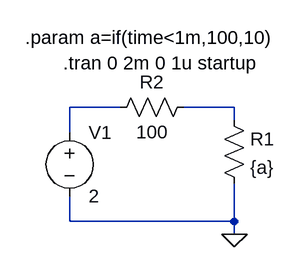
[diagram p0: schematic Draft7.asc]
Draft7.asc, the LTspice schematic file:
Version 4
SHEET 1 880 680
WIRE 192 144 128 144
WIRE 336 144 272 144
WIRE 336 160 336 144
WIRE 128 176 128 144
WIRE 128 288 128 256
WIRE 336 288 336 240
WIRE 336 288 128 288
WIRE 336 304 336 288
FLAG 336 304 0
SYMBOL voltage 128 160 R0
WINDOW 123 0 0 Left 0
WINDOW 39 0 0 Left 0
SYMATTR InstName V1
SYMATTR Value 2
SYMBOL res 320 144 R0
SYMATTR InstName R1
SYMATTR Value {a}
SYMBOL res 288 128 R90
WINDOW 0 0 56 VBottom 2
WINDOW 3 32 56 VTop 2
SYMATTR InstName R2
SYMATTR Value 100
TEXT 72 56 Left 2 !.param a=if(time<1m,100,10)
TEXT 120 88 Left 2 !.tran 0 2m 0 1u startup

The netlist it stands for:
* Draft7.asc
V1 N001 0 2
R1 N002 0 {a}
R2 N002 N001 100
.param a=if(time<1m,100,10)
.tran 0 2m 0 1u startup
.backanno
.end